# Altium schematic sheet Cables.SchDoc
size A4; DocumentNumber: 11; SheetNumber: 11; SheetTotal: 11
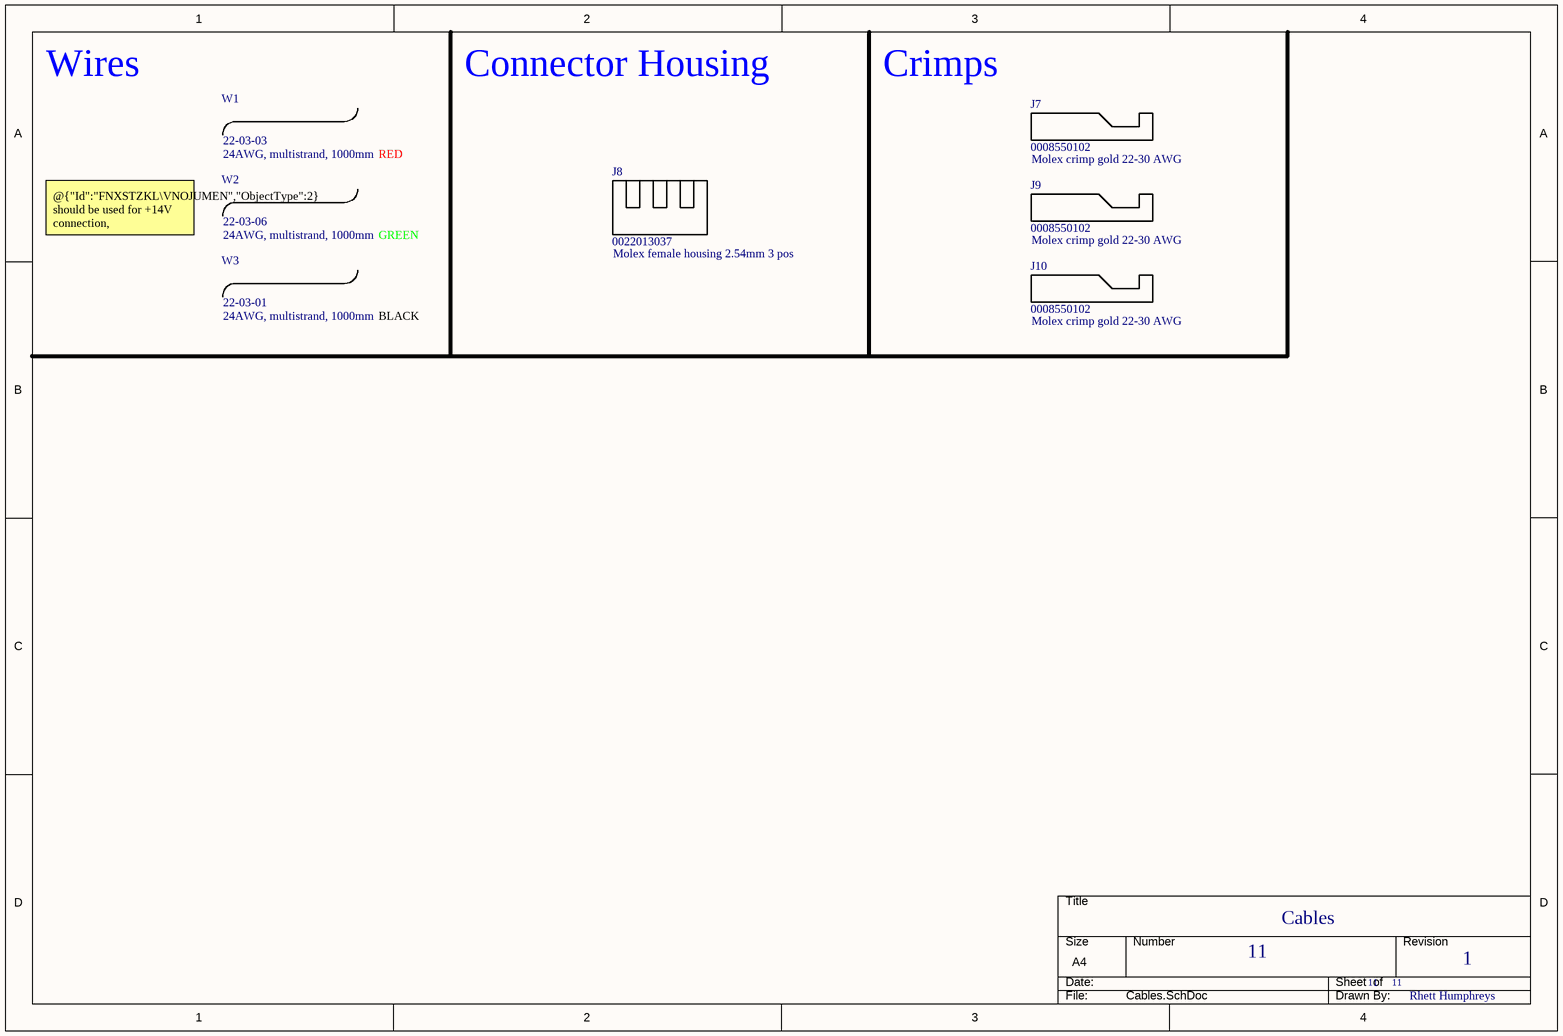
[diagram p0: Cables.SchDoc]

## Parts
J7  0008550102
J8  0022013037
J9  0008550102
J10  0008550102
W1  24AWG, multistrand, 1000mm
W2  24AWG, multistrand, 1000mm
W3  24AWG, multistrand, 1000mm

## Notes on the sheet
- Wires
- Connector Housing
- Crimps
- (near W1) 22-03-03
- RED
- Molex crimp gold 22-30 AWG
- @{"Id":"FNXSTZKL\VNOJUMEN","ObjectType":2} should be used for +14V connection, @{"Id":"FNXSTZKL\PRHJPKLT","ObjectType":2} for GND and @{"Id":"FNXSTZKL\YBQYJNNN","ObjectType":2} for -14V
- (near W2) 22-03-06
- GREEN
- (near W3) 22-03-01
- (near J8) Molex female housing 2.54mm 3 pos
- BLACK
- (near J10) Molex crimp gold 22-30 AWG
- Cables
- 11
- 1
- Rhett Humphreys

## Library data of the parts
W1-W3 = Wire 22AWG